# Altium schematic sheet DPT2.4.SchDoc
size A2; SheetNumber: 1; SheetTotal: 3
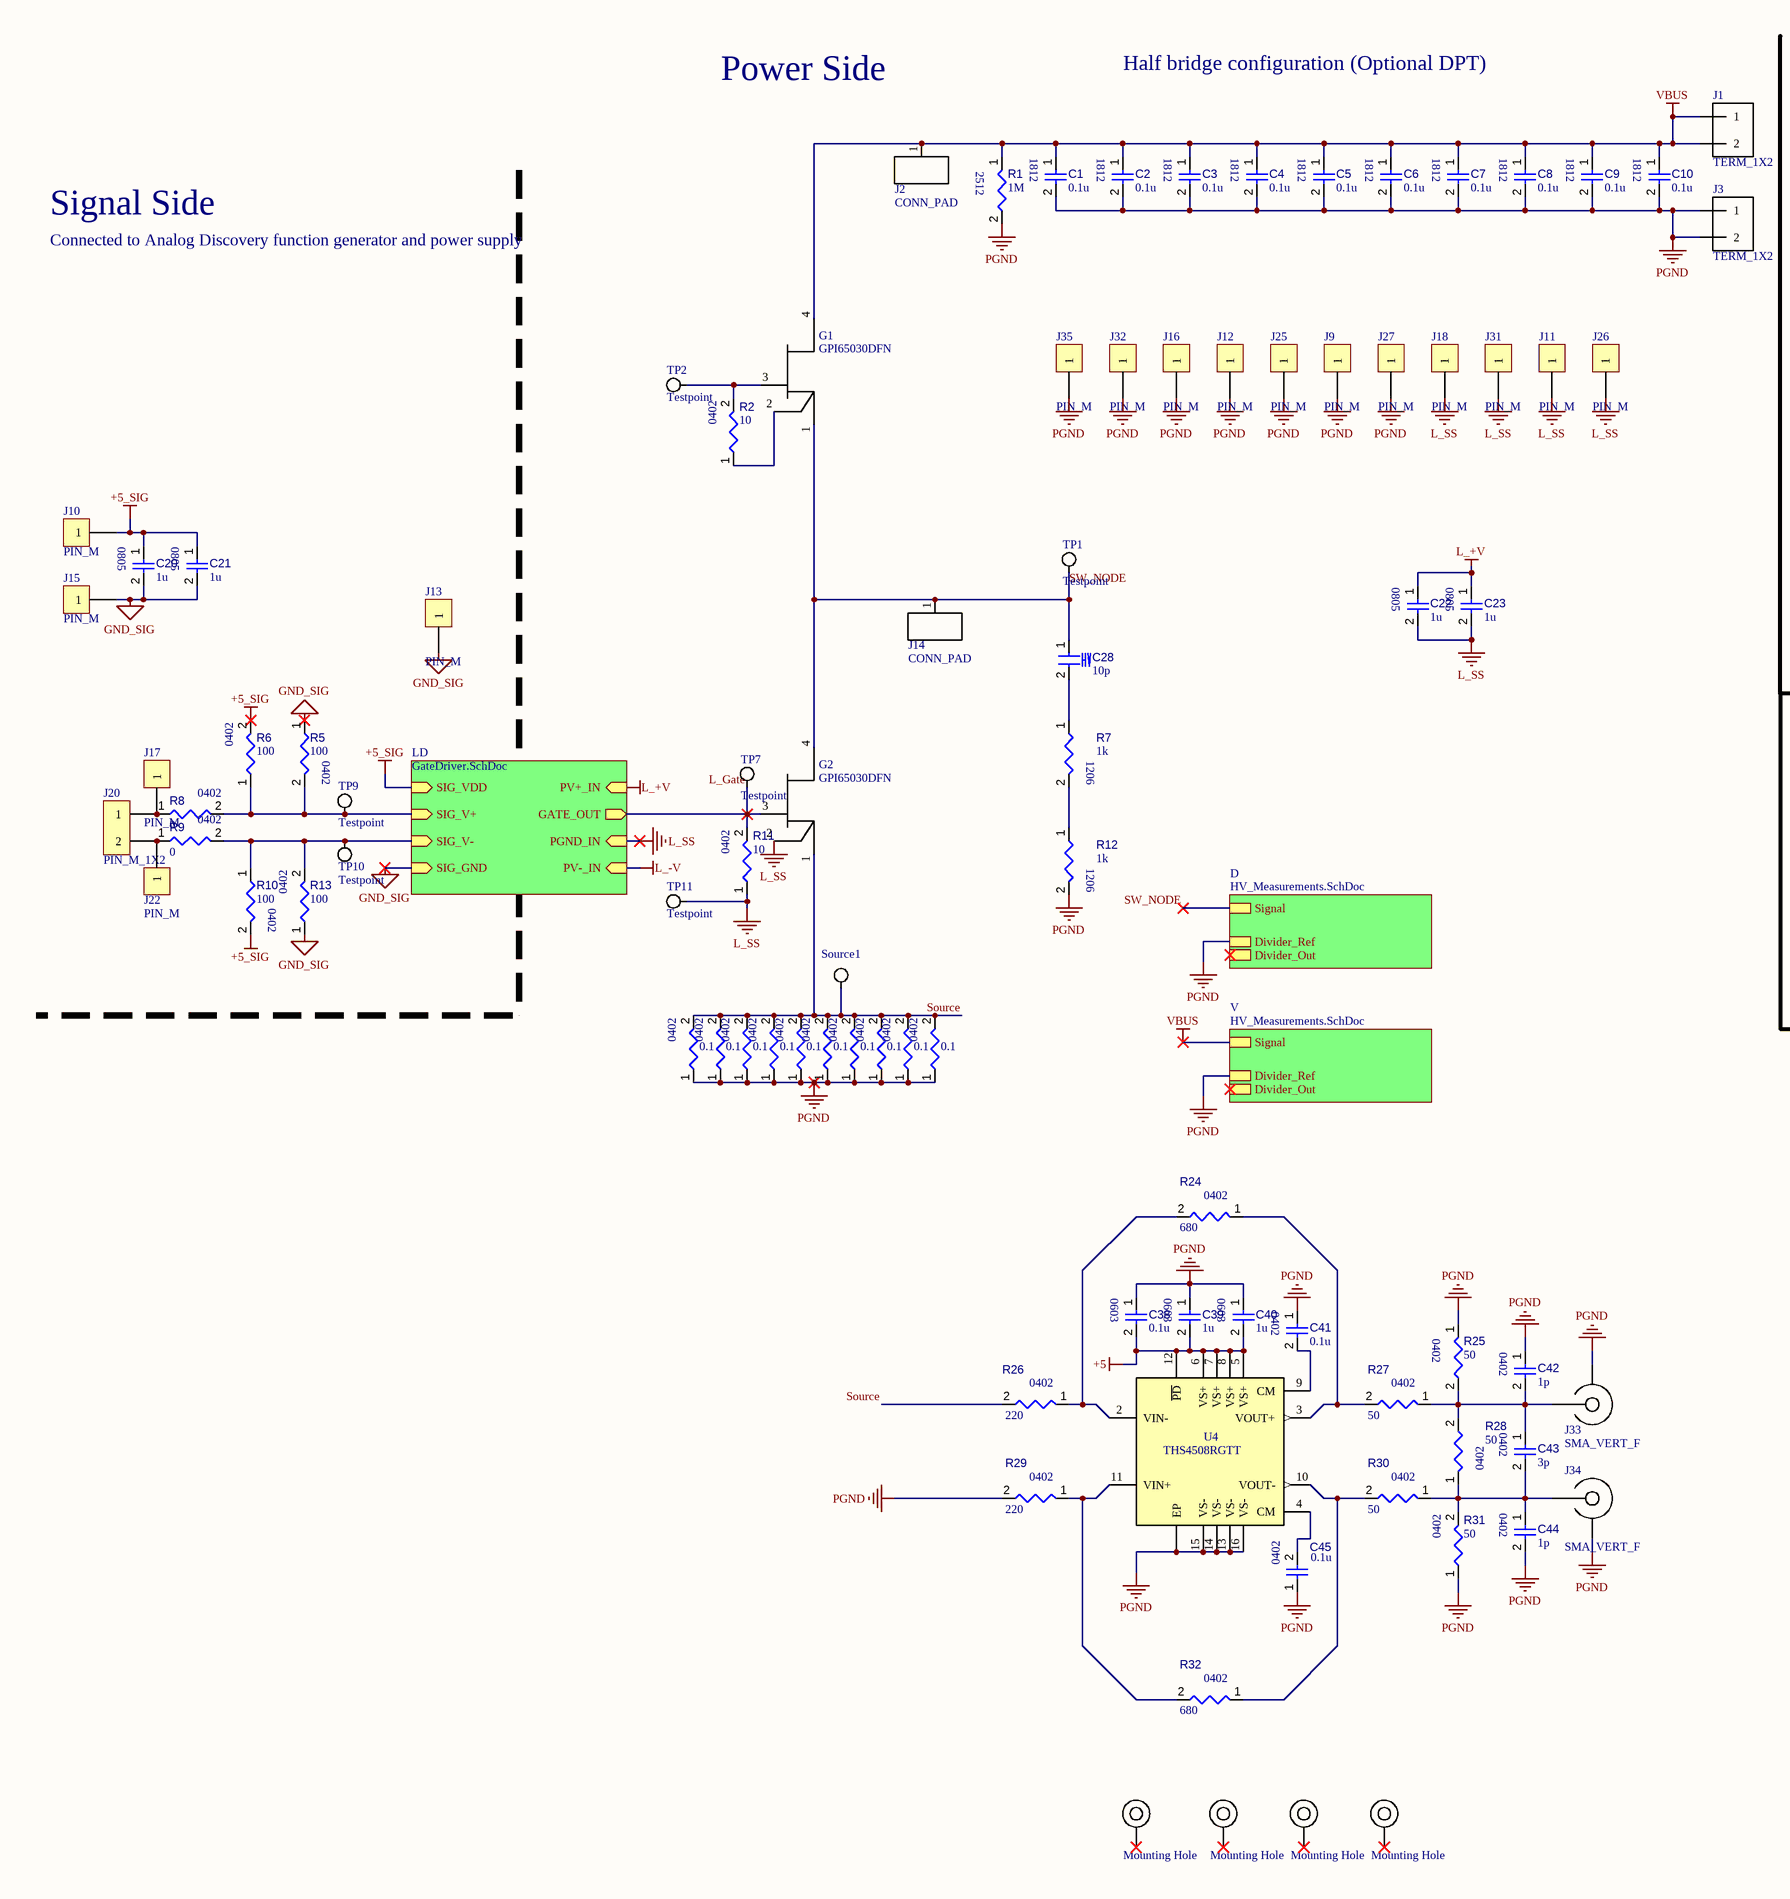
[diagram p0: DPT2.4.SchDoc, left]
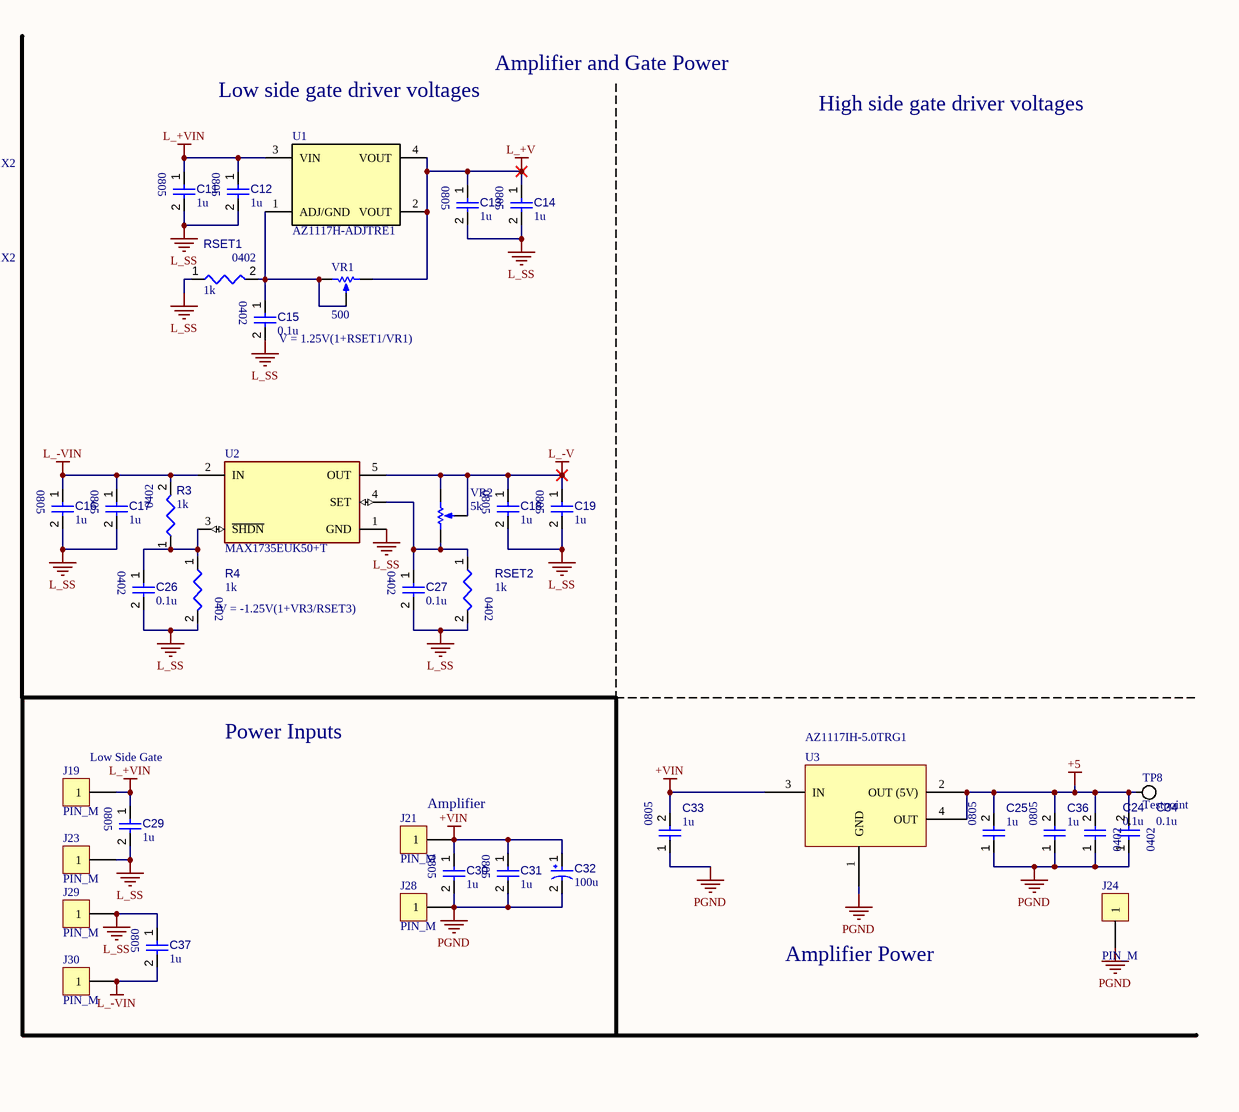
[diagram p1: DPT2.4.SchDoc, right]

## Parts
C1  value 0.1u  [CAP_1812]  (hidden comment: CAP-1812)
C2  value 0.1u  [CAP_1812]  (hidden comment: CAP-1812)
C3  value 0.1u  [CAP_1812]  (hidden comment: CAP-1812)
C4  value 0.1u  [CAP_1812]  (hidden comment: CAP-1812)
C5  value 0.1u  [CAP_1812]  (hidden comment: CAP-1812)
C6  value 0.1u  [CAP_1812]  (hidden comment: CAP-1812)
C7  value 0.1u  [CAP_1812]  (hidden comment: CAP-1812)
C8  value 0.1u  [CAP_1812]  (hidden comment: CAP-1812)
C9  value 0.1u  [CAP_1812]  (hidden comment: CAP-1812)
C10  value 0.1u  [CAP_1812]  (hidden comment: CAP-1812)
C11  value 1u  [CAP_0805_MED]  (hidden comment: CAP-0805)
C12  value 1u  [CAP_0805_MED]  (hidden comment: CAP-0805)
C13  value 1u  [CAP_0805_MED]  (hidden comment: CAP-0805)
C14  value 1u  [CAP_0805_MED]  (hidden comment: CAP-0805)
C15  value 0.1u  [CAP_0402_HIGH]  (hidden comment: CAP-0402)
C16  value 1u  [CAP_0805_MED]  (hidden comment: CAP-0805)
C17  value 1u  [CAP_0805_MED]  (hidden comment: CAP-0805)
C18  value 1u  [CAP_0805_MED]  (hidden comment: CAP-0805)
C19  value 1u  [CAP_0805_MED]  (hidden comment: CAP-0805)
C20  value 1u  [CAP_0805_MED]  (hidden comment: CAP-0805)
C21  value 1u  [CAP_0805_MED]  (hidden comment: CAP-0805)
C22  value 1u  [CAP_0805_MED]  (hidden comment: CAP-0805)
C23  value 1u  [CAP_0805_MED]  (hidden comment: CAP-0805)
C24  value 0.1u  [CAP_0402_HIGH]  (hidden comment: CAP-0402)
C25  value 1u  [CAP_0805_MED]  (hidden comment: CAP-0805)
C26  value 0.1u  [CAP_0402_HIGH]  (hidden comment: CAP-0402)
C27  value 0.1u  [CAP_0402_HIGH]  (hidden comment: CAP-0402)
C28  value 10p  [CAP_1206_HV]  (hidden comment: CAP-1206-HV)
C29  value 1u  [CAP_0805_MED]  (hidden comment: CAP-0805)
C30  value 1u  [CAP_0805_MED]  (hidden comment: CAP-0805)
C31  value 1u  [CAP_0805_MED]  (hidden comment: CAP-0805)
C32  value 100u  [PCAP_2MM_5MM]  (hidden comment: PCAP-2MMx5MM)
C33  value 1u  [CAP_0805_MED]  (hidden comment: CAP-0805)
C34  value 0.1u  [CAP_0402_HIGH]  (hidden comment: CAP-0402)
C36  value 1u  [CAP_0805_MED]  (hidden comment: CAP-0805)
C37  value 1u  [CAP_0805_MED]  (hidden comment: CAP-0805)
C38  value 0.1u  [CAP_0603_HIGH]  (hidden comment: CAP-0603)
C39  value 1u  [CAP_0603_HIGH]  (hidden comment: CAP-0603)
C40  value 1u  [CAP_0603_HIGH]  (hidden comment: CAP-0603)
C41  value 0.1u  [CAP_0402_HIGH]  (hidden comment: CAP-0402)
C42  value 1p  [CAP_0402_HIGH]  (hidden comment: CAP-0402)
C43  value 3p  [CAP_0402_HIGH]  (hidden comment: CAP-0402)
C44  value 1p  [CAP_0402_HIGH]  (hidden comment: CAP-0402)
C45  value 0.1u  [CAP_0402_HIGH]  (hidden comment: CAP-0402)
G1  GPI65030DFN  [DFN_8X8]
G2  GPI65030DFN  [DFN_8X8]
J1  TERM_1X2  [J_TERM_BLK_1X2]
J2  CONN_PAD  [CONN_PAD]
J3  TERM_1X2  [J_TERM_BLK_1X2]
J9  PIN_M  [J_THT_1_PIN]
J10  PIN_M  [J_THT_1_PIN]
J11  PIN_M  [J_THT_1_PIN]
J12  PIN_M  [J_THT_1_PIN]
J13  PIN_M  [J_THT_1_PIN]
J14  CONN_PAD  [CONN_PAD]
J15  PIN_M  [J_THT_1_PIN]
J16  PIN_M  [J_THT_1_PIN]
J17  PIN_M  [J_THT_1_PIN]
J18  PIN_M  [J_THT_1_PIN]
J19  PIN_M  [J_THT_1_PIN]
J20  PIN_M_1X2  [J_THT_2.54MM_1X2]
J21  PIN_M  [J_THT_1_PIN]
J22  PIN_M  [J_THT_1_PIN]
J23  PIN_M  [J_THT_1_PIN]
J24  PIN_M  [J_THT_1_PIN]
J25  PIN_M  [J_THT_1_PIN]
J26  PIN_M  [J_THT_1_PIN]
J27  PIN_M  [J_THT_1_PIN]
J28  PIN_M  [J_THT_1_PIN]
J29  PIN_M  [J_THT_1_PIN]
J30  PIN_M  [J_THT_1_PIN]
J31  PIN_M  [J_THT_1_PIN]
J32  PIN_M  [J_THT_1_PIN]
J33  SMA_VERT_F  [SMA_VERT_F]
J34  SMA_VERT_F  [SMA_VERT_F]
J35  PIN_M  [J_THT_1_PIN]
MH1  Mounting Hole  [Mounting Hole-Footprint-1]
MH2  Mounting Hole  [Mounting Hole-Footprint-1]
MH3  Mounting Hole  [Mounting Hole-Footprint-1]
MH4  Mounting Hole  [Mounting Hole-Footprint-1]
R1  value 1M  [RES_2512_MED]  (hidden comment: RES-2512)
R2  value 10  [RES_0402_HIGH]  (hidden comment: RES-0402)
R3  value 1k  [RES_0402_HIGH]  (hidden comment: RES-0402)
R4  value 1k  [RES_0402_HIGH]  (hidden comment: RES-0402)
R5  value 100  [RES_0402_HIGH]  (hidden comment: RES-0402)
R6  value 100  [RES_0402_HIGH]  (hidden comment: RES-0402)
R7  value 1k  [RES_1206_MED]  (hidden comment: RES-1206)
R8  value 0  [RES_0402_HIGH]  (hidden comment: RES-0402)
R9  value 0  [RES_0402_HIGH]  (hidden comment: RES-0402)
R10  value 100  [RES_0402_HIGH]  (hidden comment: RES-0402)
R11  value 10  [RES_0402_HIGH]  (hidden comment: RES-0402)
R12  value 1k  [RES_1206_MED]  (hidden comment: RES-1206)
R13  value 100  [RES_0402_HIGH]  (hidden comment: RES-0402)
R14  value 0.1  [RES_0402_HIGH]  (hidden comment: RES-0402)
R15  value 0.1  [RES_0402_HIGH]  (hidden comment: RES-0402)
R16  value 0.1  [RES_0402_HIGH]  (hidden comment: RES-0402)
R17  value 0.1  [RES_0402_HIGH]  (hidden comment: RES-0402)
R18  value 0.1  [RES_0402_HIGH]  (hidden comment: RES-0402)
R19  value 0.1  [RES_0402_HIGH]  (hidden comment: RES-0402)
R20  value 0.1  [RES_0402_HIGH]  (hidden comment: RES-0402)
R21  value 0.1  [RES_0402_HIGH]  (hidden comment: RES-0402)
R22  value 0.1  [RES_0402_HIGH]  (hidden comment: RES-0402)
R23  value 0.1  [RES_0402_HIGH]  (hidden comment: RES-0402)
R24  value 680  [RES_0402_HIGH]  (hidden comment: RES-0402)
R25  value 50  [RES_0402_HIGH]  (hidden comment: RES-0402)
R26  value 220  [RES_0402_HIGH]  (hidden comment: RES-0402)
R27  value 50  [RES_0402_HIGH]  (hidden comment: RES-0402)
R28  value 50  [RES_0402_HIGH]  (hidden comment: RES-0402)
R29  value 220  [RES_0402_HIGH]  (hidden comment: RES-0402)
R30  value 50  [RES_0402_HIGH]  (hidden comment: RES-0402)
R31  value 50  [RES_0402_HIGH]  (hidden comment: RES-0402)
R32  value 680  [RES_0402_HIGH]  (hidden comment: RES-0402)
RSET1  value 1k  [RES_0402_HIGH]  (hidden comment: RES-0402)
RSET2  value 1k  [RES_0402_HIGH]  (hidden comment: RES-0402)
Source1  Testpoint  [Testpoint-Footprint-1]  (value not drawn)
TP1  Testpoint  [Testpoint-Footprint-1]
TP2  Testpoint  [Testpoint-Footprint-1]
TP7  Testpoint  [Testpoint-Footprint-1]
TP8  Testpoint  [Testpoint-Footprint-1]
TP9  Testpoint  [Testpoint-Footprint-1]
TP10  Testpoint  [Testpoint-Footprint-1]
TP11  Testpoint  [Testpoint-Footprint-1]
U1  AZ1117H-ADJTRE1  [SOT-223]
U2  MAX1735EUK50+T  [FP-U5-2-IPC_B]
U3  AZ1117IH-5.0TRG1  [SOT230P700X180-4N]
U4  THS4508RGTT  [QFN-16]
VR1  value 500  [TRIM_J-LEAD]  (hidden comment: RES_POT_JLEAD)
VR2  value 5k  [TRIM_J-LEAD]  (hidden comment: RES_POT_JLEAD)

## Sub-sheets
D = HV_Measurements.SchDoc: Divider_Ref, Divider_Out, Signal
LD = GateDriver.SchDoc: GATE_OUT (out), SIG_V+ (in), SIG_V- (in), SIG_GND (in), SIG_VDD (in), PGND_IN (in), PV+_IN (in), PV-_IN (in)
V = HV_Measurements.SchDoc: Divider_Ref, Divider_Out, Signal

## Nets
+5: C24.2 C25.2 C34.2 C36.2 C38.2 C39.2 C40.2 TP8.1 U3.2(OUT_(5V)) U3.4(OUT) U4.5(VS+) U4.6(VS+) U4.7(VS+) U4.8(VS+) U4.12(~{PD})
+5_SIG: C20.1 C21.1 J10.1 R6.2 R10.2 ; sheet LD/SIG_VDD
+VIN: C30.1 C31.1 C32.1 C33.2 J21.1 U3.3(IN)
GND_SIG: C20.2 C21.2 J13.1 J15.1 R5.1 R13.1 ; sheet LD/SIG_GND
L_+V: C13.1 C14.1 C22.1 C23.1 U1.2(VOUT) U1.4(VOUT) VR1.1(CCW) ; sheet LD/PV+_IN
L_+VIN: C11.1 C12.1 C29.1 J19.1 U1.3(VIN)
L_-V: C18.1 C19.1 U2.5(OUT) VR2.2(S) VR2.3(CW) ; sheet LD/PV-_IN
L_-VIN: C16.1 C17.1 C37.2 J30.1 R3.2 U2.2(IN)
L_SS: C11.2 C12.2 C13.2 C14.2 C15.2 C16.2 C17.2 C18.2 C19.2 C22.2 C23.2 C26.2 C27.2 C29.2 C37.1 G2.2(KS) J11.1 J18.1 J23.1 J26.1 J29.1 J31.1 R4.2 R11.1 RSET1.1 RSET2.2 TP11.1 U2.1(GND) ; sheet LD/PGND_IN
PGND: C1.2 C2.2 C3.2 C4.2 C5.2 C6.2 C7.2 C8.2 C9.2 C10.2 C24.1 C25.1 C30.2 C31.2 C32.2 C33.1 C34.1 C36.1 C38.1 C39.1 C40.1 C41.1 C42.1 C44.2 C45.1 J3.1 J3.2 J9.1 J12.1 J16.1 J24.1 J25.1 J27.1 J28.1 J32.1 J33.2 J34.2 J35.1 R1.2 R12.2 R14.1 R15.1 R16.1 R17.1 R18.1 R19.1 R20.1 R21.1 R22.1 R23.1 R25.1 R29.2 R31.1 U3.1(GND) U4.13(VS-) U4.14(VS-) U4.15(VS-) U4.16(VS-) U4.17(EP) ; sheet V/Divider_Ref, sheet D/Divider_Ref
VBUS: C1.1 C2.1 C3.1 C4.1 C5.1 C6.1 C7.1 C8.1 C9.1 C10.1 G1.4(D) J1.1 J1.2 J2.1 R1.1 ; sheet V/Signal
L_Gate: G2.3(G) R11.2 TP7.1 ; sheet LD/GATE_OUT
Source: G2.1(S) R14.2 R15.2 R16.2 R17.2 R18.2 R19.2 R20.2 R21.2 R22.2 R23.2 R26.2 Source1.1
SW_NODE: C28.1 G1.1(S) G2.4(D) J14.1 TP1.1 ; sheet D/Signal
NetC15_1: C15.1 RSET1.2 U1.1(ADJ/GND) VR1.2(S) VR1.3(CW)
NetC26_1: C26.1 R3.1 R4.1 U2.3(~{SHDN})
NetC27_1: C27.1 RSET2.1 U2.4(SET) VR2.1(CCW)
NetC28_2: C28.2 R7.1
NetC41_2: C41.2 U4.9(CM)
NetC42_2: C42.2 C43.1 J33.1 R25.2 R27.1 R28.2
NetC43_2: C43.2 C44.1 J34.1 R28.1 R30.1 R31.2
NetC45_2: C45.2 U4.4(CM)
NetG1_2: G1.2(KS) R2.1
NetG1_3: G1.3(G) R2.2 TP2.1
NetJ17_1: J17.1 J20.1 R8.1
NetJ20_2: J20.2 J22.1 R9.1
NetR5_2: R5.2 R6.1 R8.2 TP9.1 ; sheet LD/SIG_V+
NetR7_2: R7.2 R12.1
NetR9_2: R9.2 R10.1 R13.2 TP10.1 ; sheet LD/SIG_V-
NetR24_1: R24.1 R27.2 U4.3(VOUT+)
NetR24_2: R24.2 R26.1 U4.2(VIN-)
NetR29_1: R29.1 R32.2 U4.11(VIN+)
NetR30_2: R30.2 R32.1 U4.10(VOUT-)

Not connected (* = marked no-connect by the designer): MH1 1(GND)*; MH2 1(GND)*; MH3 1(GND)*; MH4 1(GND)*

## Notes on the sheet
- Power Side
- Half bridge configuration (Optional DPT)
- Low side gate driver voltages
- Amplifier and Gate Power
- High side gate driver voltages
- Signal Side
- Connected to Analog Discovery function generator and power supply
- (near C15) V = 1.25V(1+RSET1/VR1)
- (near R4) V = -1.25V(1+VR3/RSET3)
- (near J19) Low Side Gate
- Power Inputs
- (near J21) Amplifier
- Amplifier Power

## Library data of the parts
C1-C10 = CMP-001-00088-2: Non polarized SMD capacitor - 1812 (4532 Metric); Package: 1812
C11-C14 C16-C23 C25 C29-C31 C33 C36 C37 = CMP-001-00086-3: Non polarized SMD capacitor - 0805 (1608 Metric); Package: 0805
C15 C24 C26 C27 C34 C41-C45 = CMP-001-00083-3: Non polarized SMD capacitor - 0402 (1005 Metric); Package: 0402
C28 = CMP-001-00089-1: Non polarized SMD capacitor - 1206 (3216 Metric) High Voltage; Voltage Rating: 1kV; Package: 1206
C32 = CMP-001-00091-1: Polarized THT capacitor - Radial can, 2mm lead spacing, 5mm diameter
C38-C40 = CMP-001-00084-2: Non polarized SMD capacitor - 0603 (1608 Metric); Package: 0603
G1 G2 = CMP-023-000000-5: 650V 15A GaN Enhancement mode Transistor; pin to pad: 1>1+2+9 2>3 3>4 4>5+6+7+8; Package: DFN8X8
J1 J3 = CMP-002-00071-1: Terminal Block 1X2, 6.35mm pitch
J2 J14 = CMP-002-00074-4: Solderable Connection Pad
J9-J13 J15-J19 J21-J32 J35 = CMP-002-00072-1: Male Pin, 1 Pin
J20 = CMP-002-00073-2: Male Pin 2.54mm pitch 1X2
J33 J34 = CMP-025-000000-6: SMA connector, Vertical, Female; pin to pad: 2>2+3+4+5; Package: SMA
MH1-MH4 = CMP-032-000006-1
R1 = CMP-009-00182-3: SMD Resistor - 2512 (6432 Metric); Package: 2512
R2-R6 R8-R11 R13-R32 RSET1 RSET2 = CMP-009-00177-2: SMD Resistor - 0402 (1005 Metric); Package: 0402
R7 R12 = CMP-009-00180-2: SMD Resistor - 1206 (3216 Metric); Package: 1206
Source1 TP1 TP2 TP7-TP11 = CMP-001-0000-5: testpoint for circuit
U1 = CMP-019-00050-1: IC REG LINEAR POS ADJ 1A SOT223; Package: SOT223
U2 = CMP-05721-000044-1: IC REG LIN NEG ADJ 200MA SOT23-5
U3 = CMP-032-000005-2: https://www.digikey.ca/en/products/detail/diodes-incorporated/AZ1117IH-5-0TRG1/5699673
U4 = CMP-027-000000-12: WIDEBAND, LOW NOISE, LOW DISTORTION FULLY DIFFERENTIAL AMPLIFIER; pin to pad: 17>17+18+19+20+21; Package: QFN3X3
VR1 VR2 = CMP-009-00181-2: Potentiometer, J-Lead Trim Pot; pin to pad: 2>3 3>2